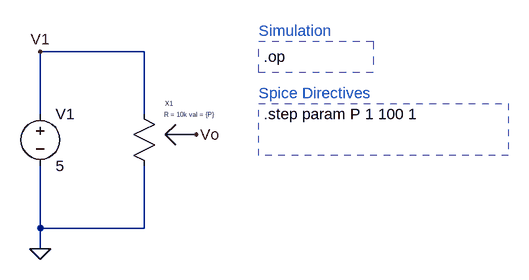
[diagram p0: schematic Variable_Resistor_3.asc]
Variable_Resistor_3.asc, the LTspice schematic file:
Version 4
SHEET 1 1432 696
WIRE 464 80 304 80
WIRE 304 176 304 80
WIRE 464 176 464 80
WIRE 304 352 304 256
WIRE 464 352 464 256
WIRE 464 352 304 352
WIRE 304 384 304 352
FLAG 304 384 0
FLAG 304 80 V1
FLAG 544 208 Vo
SYMBOL voltage 304 160 R0
SYMATTR InstName V1
SYMATTR Value 5
SYMBOL pot 448 160 R0
WINDOW 39 47 17 Left 0
SYMATTR SpiceLine R = 10k val = {P}
SYMATTR InstName X1
TEXT 640 48 Left 2 ;Simulation
TEXT 648 88 Left 2 !.op
TEXT 640 144 Left 2 ;Spice Directives
TEXT 648 176 Left 2 !.step param P 1 100 1
RECTANGLE Normal 816 112 640 64 2
RECTANGLE Normal 1024 240 640 160 2

The netlist it stands for:
* Variable_Resistor_3.asc
V1 V1 0 5
XX1 V1 Vo 0 pot R = 10k val = {P}  ; pins 1 2 3
* Simulation
.op
* Spice Directives
.step param P 1 100 1
.backanno
.end